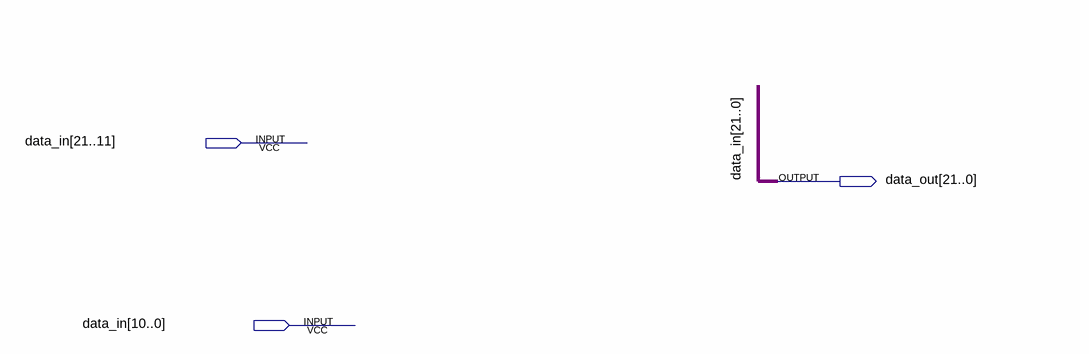
[diagram p0: schematic sheet]
// Quartus schematic data.bdf as structural Verilog: 0 symbols, 3 pins
module data (
  input  [21:0] data_in,
  output [21:0] data_out
);


  assign data_out = data_in;
endmodule
